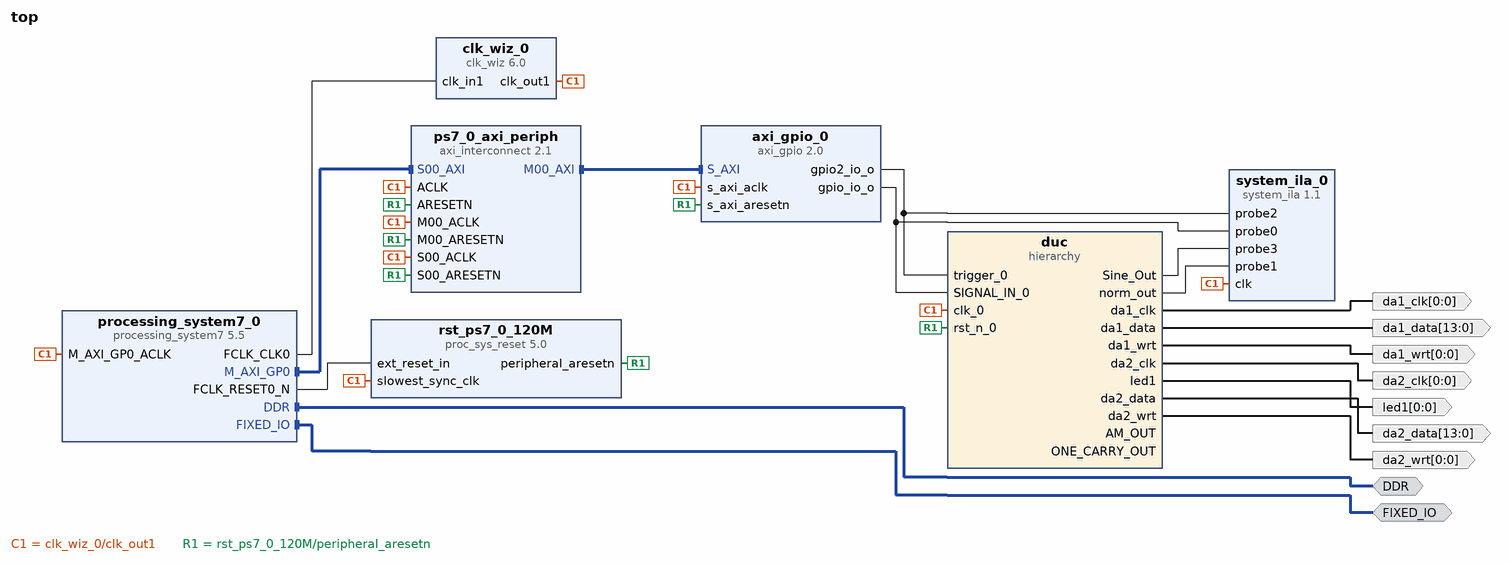
[diagram p0: block diagram of the top level]
# Vivado block design top, xc7z020clg400-2, Vivado 2023.2
create_bd_design top

create_bd_intf_port -mode Master -vlnv xilinx.com:interface:ddrx_rtl:1.0 DDR
create_bd_intf_port -mode Master -vlnv xilinx.com:display_processing_system7:fixedio_rtl:1.0 FIXED_IO
create_bd_port -dir O -from 0 -to 0 da1_clk
create_bd_port -dir O -from 0 -to 0 da1_wrt
create_bd_port -dir O -from 0 -to 0 da2_clk
create_bd_port -dir O -from 13 -to 0 da2_data
create_bd_port -dir O -from 0 -to 0 da2_wrt
create_bd_port -dir O -from 0 -to 0 led1
create_bd_port -dir O -from 13 -to 0 da1_data

create_bd_cell -type ip -vlnv xilinx.com:ip:processing_system7:5.5 processing_system7_0
set_property -dict [list \
  CONFIG.PCW_ENET0_ENET0_IO {MIO 16 .. 27} \
  CONFIG.PCW_ENET0_GRP_MDIO_ENABLE 1 \
  CONFIG.PCW_ENET0_GRP_MDIO_IO {MIO 52 .. 53} \
  CONFIG.PCW_ENET0_PERIPHERAL_ENABLE 1 \
  CONFIG.PCW_ENET0_RESET_ENABLE 0 \
  CONFIG.PCW_ENET_RESET_ENABLE 1 \
  CONFIG.PCW_ENET_RESET_SELECT {Share reset pin} \
  CONFIG.PCW_FPGA0_PERIPHERAL_FREQMHZ 120 \
  CONFIG.PCW_GPIO_EMIO_GPIO_ENABLE 1 \
  CONFIG.PCW_GPIO_EMIO_GPIO_IO 64 \
  CONFIG.PCW_GPIO_MIO_GPIO_ENABLE 1 \
  CONFIG.PCW_GPIO_MIO_GPIO_IO MIO \
  CONFIG.PCW_I2C_RESET_ENABLE 1 \
  CONFIG.PCW_IRQ_F2P_INTR 1 \
  CONFIG.PCW_PRESET_BANK1_VOLTAGE {LVCMOS 1.8V} \
  CONFIG.PCW_QSPI_GRP_SINGLE_SS_ENABLE 1 \
  CONFIG.PCW_QSPI_GRP_SINGLE_SS_IO {MIO 1 .. 6} \
  CONFIG.PCW_QSPI_PERIPHERAL_ENABLE 1 \
  CONFIG.PCW_QSPI_QSPI_IO {MIO 1 .. 6} \
  CONFIG.PCW_SD0_GRP_CD_ENABLE 1 \
  CONFIG.PCW_SD0_GRP_CD_IO {MIO 47} \
  CONFIG.PCW_SD0_GRP_WP_ENABLE 0 \
  CONFIG.PCW_SD0_PERIPHERAL_ENABLE 1 \
  CONFIG.PCW_SD0_SD0_IO {MIO 40 .. 45} \
  CONFIG.PCW_SDIO_PERIPHERAL_FREQMHZ 100 \
  CONFIG.PCW_SINGLE_QSPI_DATA_MODE x4 \
  CONFIG.PCW_UART1_PERIPHERAL_ENABLE 1 \
  CONFIG.PCW_UART1_UART1_IO {MIO 48 .. 49} \
  CONFIG.PCW_UART_PERIPHERAL_FREQMHZ 100 \
  CONFIG.PCW_UIPARAM_DDR_PARTNO {MT41J256M16 RE-125} \
  CONFIG.PCW_USB0_PERIPHERAL_ENABLE 1 \
  CONFIG.PCW_USB0_RESET_ENABLE 1 \
  CONFIG.PCW_USB0_RESET_IO {MIO 46} \
  CONFIG.PCW_USB0_USB0_IO {MIO 28 .. 39} \
  CONFIG.PCW_USB_RESET_ENABLE 1 \
  CONFIG.PCW_USB_RESET_SELECT {Share reset pin} \
  CONFIG.PCW_USE_FABRIC_INTERRUPT 1 \
] [get_bd_cells processing_system7_0]
# 207 more settings of processing_system7_0 are not shown: defaults, MIO pin electricals, DDR timing, and values the tool derives
create_bd_cell -type ip -vlnv xilinx.com:ip:axi_gpio:2.0 axi_gpio_0
set_property -dict [list \
  CONFIG.C_ALL_OUTPUTS 0 \
  CONFIG.C_ALL_OUTPUTS_2 0 \
  CONFIG.C_GPIO2_WIDTH 1 \
  CONFIG.C_GPIO_WIDTH 32 \
  CONFIG.C_INTERRUPT_PRESENT 0 \
  CONFIG.C_IS_DUAL 1 \
] [get_bd_cells axi_gpio_0]
create_bd_cell -type ip -vlnv xilinx.com:ip:axi_interconnect:2.1 ps7_0_axi_periph
set_property -dict {CONFIG.NUM_MI 1} [get_bd_cells ps7_0_axi_periph]
create_bd_cell -type ip -vlnv xilinx.com:ip:proc_sys_reset:5.0 rst_ps7_0_120M
create_bd_cell -type hier duc
create_bd_cell -type ip -vlnv xilinx.com:ip:clk_wiz:6.0 clk_wiz_0
set_property -dict [list \
  CONFIG.CLKIN1_JITTER_PS 80.0 \
  CONFIG.CLKOUT1_JITTER 213.738 \
  CONFIG.CLKOUT1_PHASE_ERROR 240.486 \
  CONFIG.CLKOUT1_REQUESTED_OUT_FREQ 120 \
  CONFIG.MMCM_CLKFBOUT_MULT_F 39.000 \
  CONFIG.MMCM_CLKIN1_PERIOD 8.000 \
  CONFIG.MMCM_CLKOUT0_DIVIDE_F 8.125 \
  CONFIG.MMCM_DIVCLK_DIVIDE 5 \
  CONFIG.PRIM_IN_FREQ 125.000 \
  CONFIG.PRIM_SOURCE No_buffer \
  CONFIG.USE_LOCKED false \
  CONFIG.USE_RESET false \
] [get_bd_cells clk_wiz_0]
create_bd_cell -type ip -vlnv xilinx.com:ip:system_ila:1.1 system_ila_0
set_property -dict [list \
  CONFIG.C_DATA_DEPTH 8192 \
  CONFIG.C_MON_TYPE NATIVE \
  CONFIG.C_NUM_OF_PROBES 4 \
  CONFIG.C_PROBE0_TYPE 0 \
  CONFIG.C_PROBE1_TYPE 0 \
  CONFIG.C_PROBE2_TYPE 0 \
  CONFIG.C_PROBE3_TYPE 0 \
] [get_bd_cells system_ila_0]

# ---- hierarchy /duc ----
current_bd_instance /duc
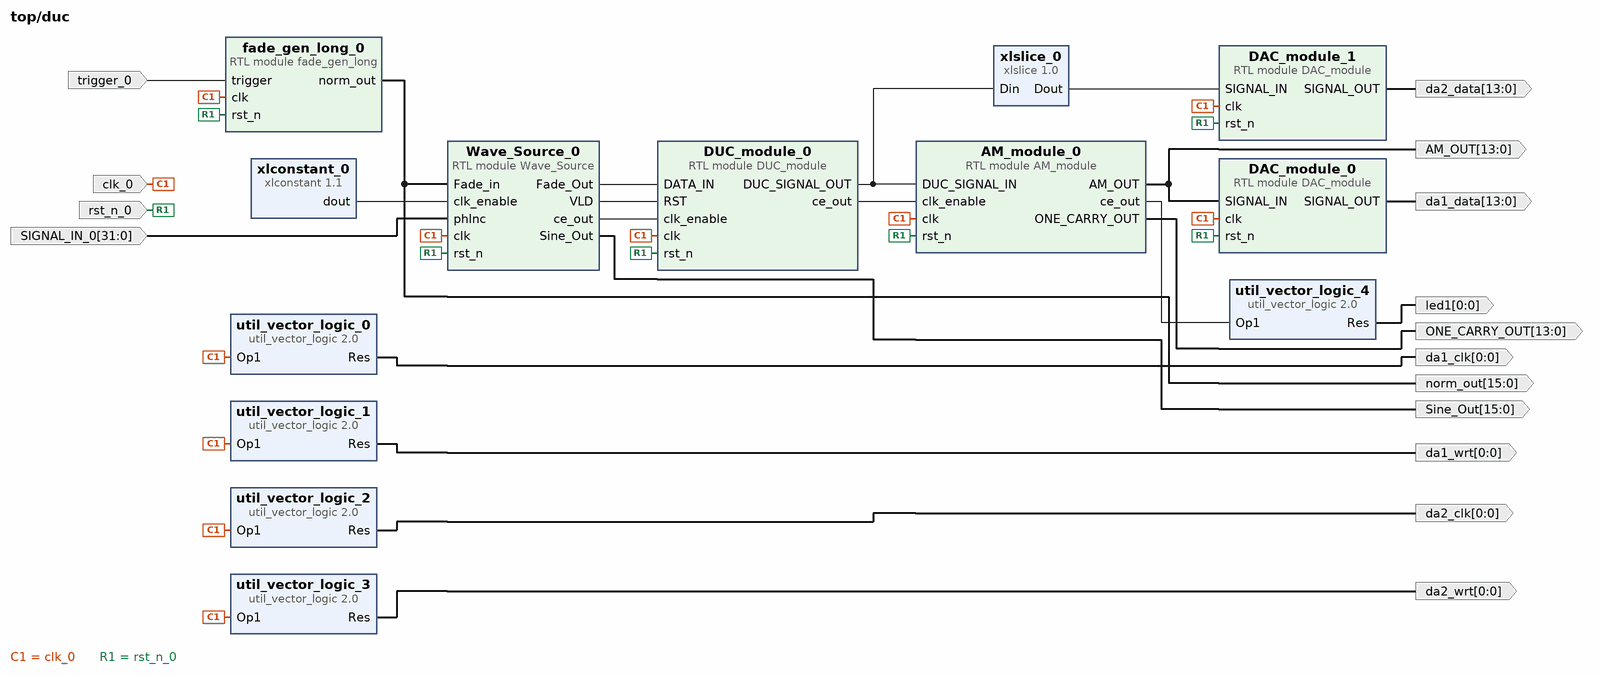
[diagram p1: block diagram inside /duc]
create_bd_pin -dir I -type rst rst_n_0
create_bd_pin -dir I -type clk clk_0
create_bd_pin -dir O -from 0 -to 0 da1_wrt
create_bd_pin -dir O -from 0 -to 0 da1_clk
create_bd_pin -dir O -from 13 -to 0 da2_data
create_bd_pin -dir O -from 0 -to 0 da2_clk
create_bd_pin -dir O -from 0 -to 0 da2_wrt
create_bd_pin -dir O -from 0 -to 0 led1
create_bd_pin -dir O -from 13 -to 0 AM_OUT
create_bd_pin -dir O -from 13 -to 0 ONE_CARRY_OUT
create_bd_pin -dir O -from 13 -to 0 da1_data
create_bd_pin -dir I -from 31 -to 0 SIGNAL_IN_0
create_bd_pin -dir I trigger_0
create_bd_pin -dir O -from 15 -to 0 Sine_Out
create_bd_pin -dir O -from 15 -to 0 norm_out

create_bd_cell -type ip -vlnv xilinx.com:ip:util_vector_logic:2.0 util_vector_logic_0
set_property -dict {CONFIG.C_OPERATION not CONFIG.C_SIZE 1} [get_bd_cells util_vector_logic_0]
create_bd_cell -type ip -vlnv xilinx.com:ip:util_vector_logic:2.0 util_vector_logic_1
set_property -dict {CONFIG.C_OPERATION not CONFIG.C_SIZE 1} [get_bd_cells util_vector_logic_1]
create_bd_cell -type ip -vlnv xilinx.com:ip:util_vector_logic:2.0 util_vector_logic_2
set_property -dict {CONFIG.C_OPERATION not CONFIG.C_SIZE 1} [get_bd_cells util_vector_logic_2]
create_bd_cell -type ip -vlnv xilinx.com:ip:util_vector_logic:2.0 util_vector_logic_3
set_property -dict {CONFIG.C_OPERATION not CONFIG.C_SIZE 1} [get_bd_cells util_vector_logic_3]
create_bd_cell -type ip -vlnv xilinx.com:ip:util_vector_logic:2.0 util_vector_logic_4
set_property -dict {CONFIG.C_OPERATION not CONFIG.C_SIZE 1} [get_bd_cells util_vector_logic_4]
create_bd_cell -type module -reference AM_module AM_module_0
create_bd_cell -type module -reference DAC_module DAC_module_0
create_bd_cell -type module -reference DAC_module DAC_module_1
create_bd_cell -type ip -vlnv xilinx.com:ip:xlslice:1.0 xlslice_0
set_property -dict {CONFIG.DIN_FROM 15 CONFIG.DIN_TO 2 CONFIG.DIN_WIDTH 16} [get_bd_cells xlslice_0]
create_bd_cell -type module -reference DUC_module DUC_module_0
create_bd_cell -type ip -vlnv xilinx.com:ip:xlconstant:1.1 xlconstant_0
create_bd_cell -type module -reference Wave_Source Wave_Source_0
create_bd_cell -type module -reference fade_gen_long fade_gen_long_0

# ---- connections ----

current_bd_instance /duc
connect_bd_net [get_bd_pins AM_module_0/AM_OUT] [get_bd_pins AM_OUT] [get_bd_pins DAC_module_0/SIGNAL_IN]
connect_bd_net [get_bd_pins AM_module_0/ONE_CARRY_OUT] [get_bd_pins ONE_CARRY_OUT]
connect_bd_net -net AM_module_0_VLD [get_bd_pins AM_module_0/ce_out] [get_bd_pins util_vector_logic_4/Op1]
connect_bd_net [get_bd_pins DAC_module_0/SIGNAL_OUT] [get_bd_pins da1_data]
connect_bd_net [get_bd_pins DAC_module_1/SIGNAL_OUT] [get_bd_pins da2_data]
connect_bd_net [get_bd_pins DUC_module_0/ce_out] [get_bd_pins AM_module_0/clk_enable]
connect_bd_net -net DUC_module_with_ready_0_DUC_SIGNAL_OUT [get_bd_pins DUC_module_0/DUC_SIGNAL_OUT] \
  [get_bd_pins xlslice_0/Din] [get_bd_pins AM_module_0/DUC_SIGNAL_IN]
connect_bd_net -net SIGNAL_IN_0_1 [get_bd_pins SIGNAL_IN_0] [get_bd_pins Wave_Source_0/phInc]
connect_bd_net [get_bd_pins Wave_Source_0/Fade_Out] [get_bd_pins DUC_module_0/DATA_IN]
connect_bd_net -net Wave_Source_0_Sine_Out [get_bd_pins Wave_Source_0/Sine_Out] [get_bd_pins Sine_Out]
connect_bd_net [get_bd_pins Wave_Source_0/VLD] [get_bd_pins DUC_module_0/RST]
connect_bd_net [get_bd_pins Wave_Source_0/ce_out] [get_bd_pins DUC_module_0/clk_enable]
connect_bd_net -net clk_0_1 [get_bd_pins clk_0] \
  [get_bd_pins DAC_module_0/clk] [get_bd_pins DAC_module_1/clk] [get_bd_pins util_vector_logic_0/Op1] \
  [get_bd_pins util_vector_logic_1/Op1] [get_bd_pins util_vector_logic_2/Op1] [get_bd_pins util_vector_logic_3/Op1] \
  [get_bd_pins AM_module_0/clk] [get_bd_pins DUC_module_0/clk] [get_bd_pins Wave_Source_0/clk] \
  [get_bd_pins fade_gen_long_0/clk]
connect_bd_net -net fade_gen_long_0_norm_out [get_bd_pins fade_gen_long_0/norm_out] [get_bd_pins Wave_Source_0/Fade_in] [get_bd_pins norm_out]
connect_bd_net -net rst_n_0_1 [get_bd_pins rst_n_0] \
  [get_bd_pins DAC_module_0/rst_n] [get_bd_pins DAC_module_1/rst_n] [get_bd_pins AM_module_0/rst_n] \
  [get_bd_pins DUC_module_0/rst_n] [get_bd_pins Wave_Source_0/rst_n] [get_bd_pins fade_gen_long_0/rst_n]
connect_bd_net -net trigger_0_1 [get_bd_pins trigger_0] [get_bd_pins fade_gen_long_0/trigger]
connect_bd_net [get_bd_pins util_vector_logic_0/Res] [get_bd_pins da1_clk]
connect_bd_net [get_bd_pins util_vector_logic_1/Res] [get_bd_pins da1_wrt]
connect_bd_net [get_bd_pins util_vector_logic_2/Res] [get_bd_pins da2_clk]
connect_bd_net [get_bd_pins util_vector_logic_3/Res] [get_bd_pins da2_wrt]
connect_bd_net [get_bd_pins util_vector_logic_4/Res] [get_bd_pins led1]
connect_bd_net [get_bd_pins xlconstant_0/dout] [get_bd_pins Wave_Source_0/clk_enable]
connect_bd_net [get_bd_pins xlslice_0/Dout] [get_bd_pins DAC_module_1/SIGNAL_IN]
set_property HDL_ATTRIBUTE.DEBUG true [get_bd_nets SIGNAL_IN_0_1]
set_property HDL_ATTRIBUTE.DEBUG true [get_bd_nets Wave_Source_0_Sine_Out]
set_property HDL_ATTRIBUTE.MARK_DEBUG true [get_bd_nets Wave_Source_0_Sine_Out]
set_property HDL_ATTRIBUTE.DEBUG true [get_bd_nets fade_gen_long_0_norm_out]
set_property HDL_ATTRIBUTE.MARK_DEBUG true [get_bd_nets fade_gen_long_0_norm_out]
set_property HDL_ATTRIBUTE.DEBUG true [get_bd_nets trigger_0_1]

current_bd_instance /
connect_bd_intf_net [get_bd_intf_ports DDR] [get_bd_intf_pins processing_system7_0/DDR]
connect_bd_intf_net [get_bd_intf_ports FIXED_IO] [get_bd_intf_pins processing_system7_0/FIXED_IO]
connect_bd_intf_net [get_bd_intf_pins processing_system7_0/M_AXI_GP0] [get_bd_intf_pins ps7_0_axi_periph/S00_AXI]
connect_bd_intf_net [get_bd_intf_pins ps7_0_axi_periph/M00_AXI] [get_bd_intf_pins axi_gpio_0/S_AXI]
connect_bd_net -net axi_gpio_0_gpio2_io_o [get_bd_pins axi_gpio_0/gpio2_io_o] [get_bd_pins duc/trigger_0] [get_bd_pins system_ila_0/probe2]
connect_bd_net -net axi_gpio_0_gpio_io_o [get_bd_pins axi_gpio_0/gpio_io_o] [get_bd_pins duc/SIGNAL_IN_0] [get_bd_pins system_ila_0/probe0]
# net duc_AM_OUT has one end: duc/AM_OUT
# net duc_ONE_CARRY_OUT has one end: duc/ONE_CARRY_OUT
connect_bd_net -net duc_Sine_Out [get_bd_pins duc/Sine_Out] [get_bd_pins system_ila_0/probe3]
connect_bd_net -net duc_VLD_0 [get_bd_pins duc/led1] [get_bd_ports led1]
connect_bd_net [get_bd_pins duc/da1_clk] [get_bd_ports da1_clk]
connect_bd_net [get_bd_pins duc/da1_data] [get_bd_ports da1_data]
connect_bd_net [get_bd_pins duc/da1_wrt] [get_bd_ports da1_wrt]
connect_bd_net [get_bd_pins duc/da2_clk] [get_bd_ports da2_clk]
connect_bd_net [get_bd_pins duc/da2_data] [get_bd_ports da2_data]
connect_bd_net [get_bd_pins duc/da2_wrt] [get_bd_ports da2_wrt]
connect_bd_net -net duc_norm_out [get_bd_pins duc/norm_out] [get_bd_pins system_ila_0/probe1]
connect_bd_net -net processing_system7_0_FCLK_CLK0 [get_bd_pins clk_wiz_0/clk_out1] \
  [get_bd_pins processing_system7_0/M_AXI_GP0_ACLK] [get_bd_pins duc/clk_0] [get_bd_pins axi_gpio_0/s_axi_aclk] \
  [get_bd_pins ps7_0_axi_periph/ACLK] [get_bd_pins ps7_0_axi_periph/S00_ACLK] [get_bd_pins ps7_0_axi_periph/M00_ACLK] \
  [get_bd_pins rst_ps7_0_120M/slowest_sync_clk] [get_bd_pins system_ila_0/clk]
connect_bd_net [get_bd_pins processing_system7_0/FCLK_CLK0] [get_bd_pins clk_wiz_0/clk_in1]
connect_bd_net [get_bd_pins processing_system7_0/FCLK_RESET0_N] [get_bd_pins rst_ps7_0_120M/ext_reset_in]
connect_bd_net [get_bd_pins rst_ps7_0_120M/peripheral_aresetn] \
  [get_bd_pins duc/rst_n_0] [get_bd_pins axi_gpio_0/s_axi_aresetn] [get_bd_pins ps7_0_axi_periph/ARESETN] \
  [get_bd_pins ps7_0_axi_periph/S00_ARESETN] [get_bd_pins ps7_0_axi_periph/M00_ARESETN]
set_property HDL_ATTRIBUTE.DEBUG true [get_bd_nets axi_gpio_0_gpio2_io_o]
set_property HDL_ATTRIBUTE.MARK_DEBUG true [get_bd_nets axi_gpio_0_gpio2_io_o]
set_property HDL_ATTRIBUTE.DEBUG true [get_bd_nets axi_gpio_0_gpio_io_o]
set_property HDL_ATTRIBUTE.MARK_DEBUG true [get_bd_nets axi_gpio_0_gpio_io_o]
set_property HDL_ATTRIBUTE.DEBUG true [get_bd_nets duc_Sine_Out]
set_property HDL_ATTRIBUTE.DEBUG true [get_bd_nets duc_norm_out]

# ---- address map ----
assign_bd_address -offset 0x41200000 -range 64K -target_address_space [get_bd_addr_spaces processing_system7_0/Data] [get_bd_addr_segs axi_gpio_0/S_AXI/Reg]

validate_bd_design
save_bd_design
